# EAGLE design TPDH-Walrus_HardMount (EAGLE 9.4.2)
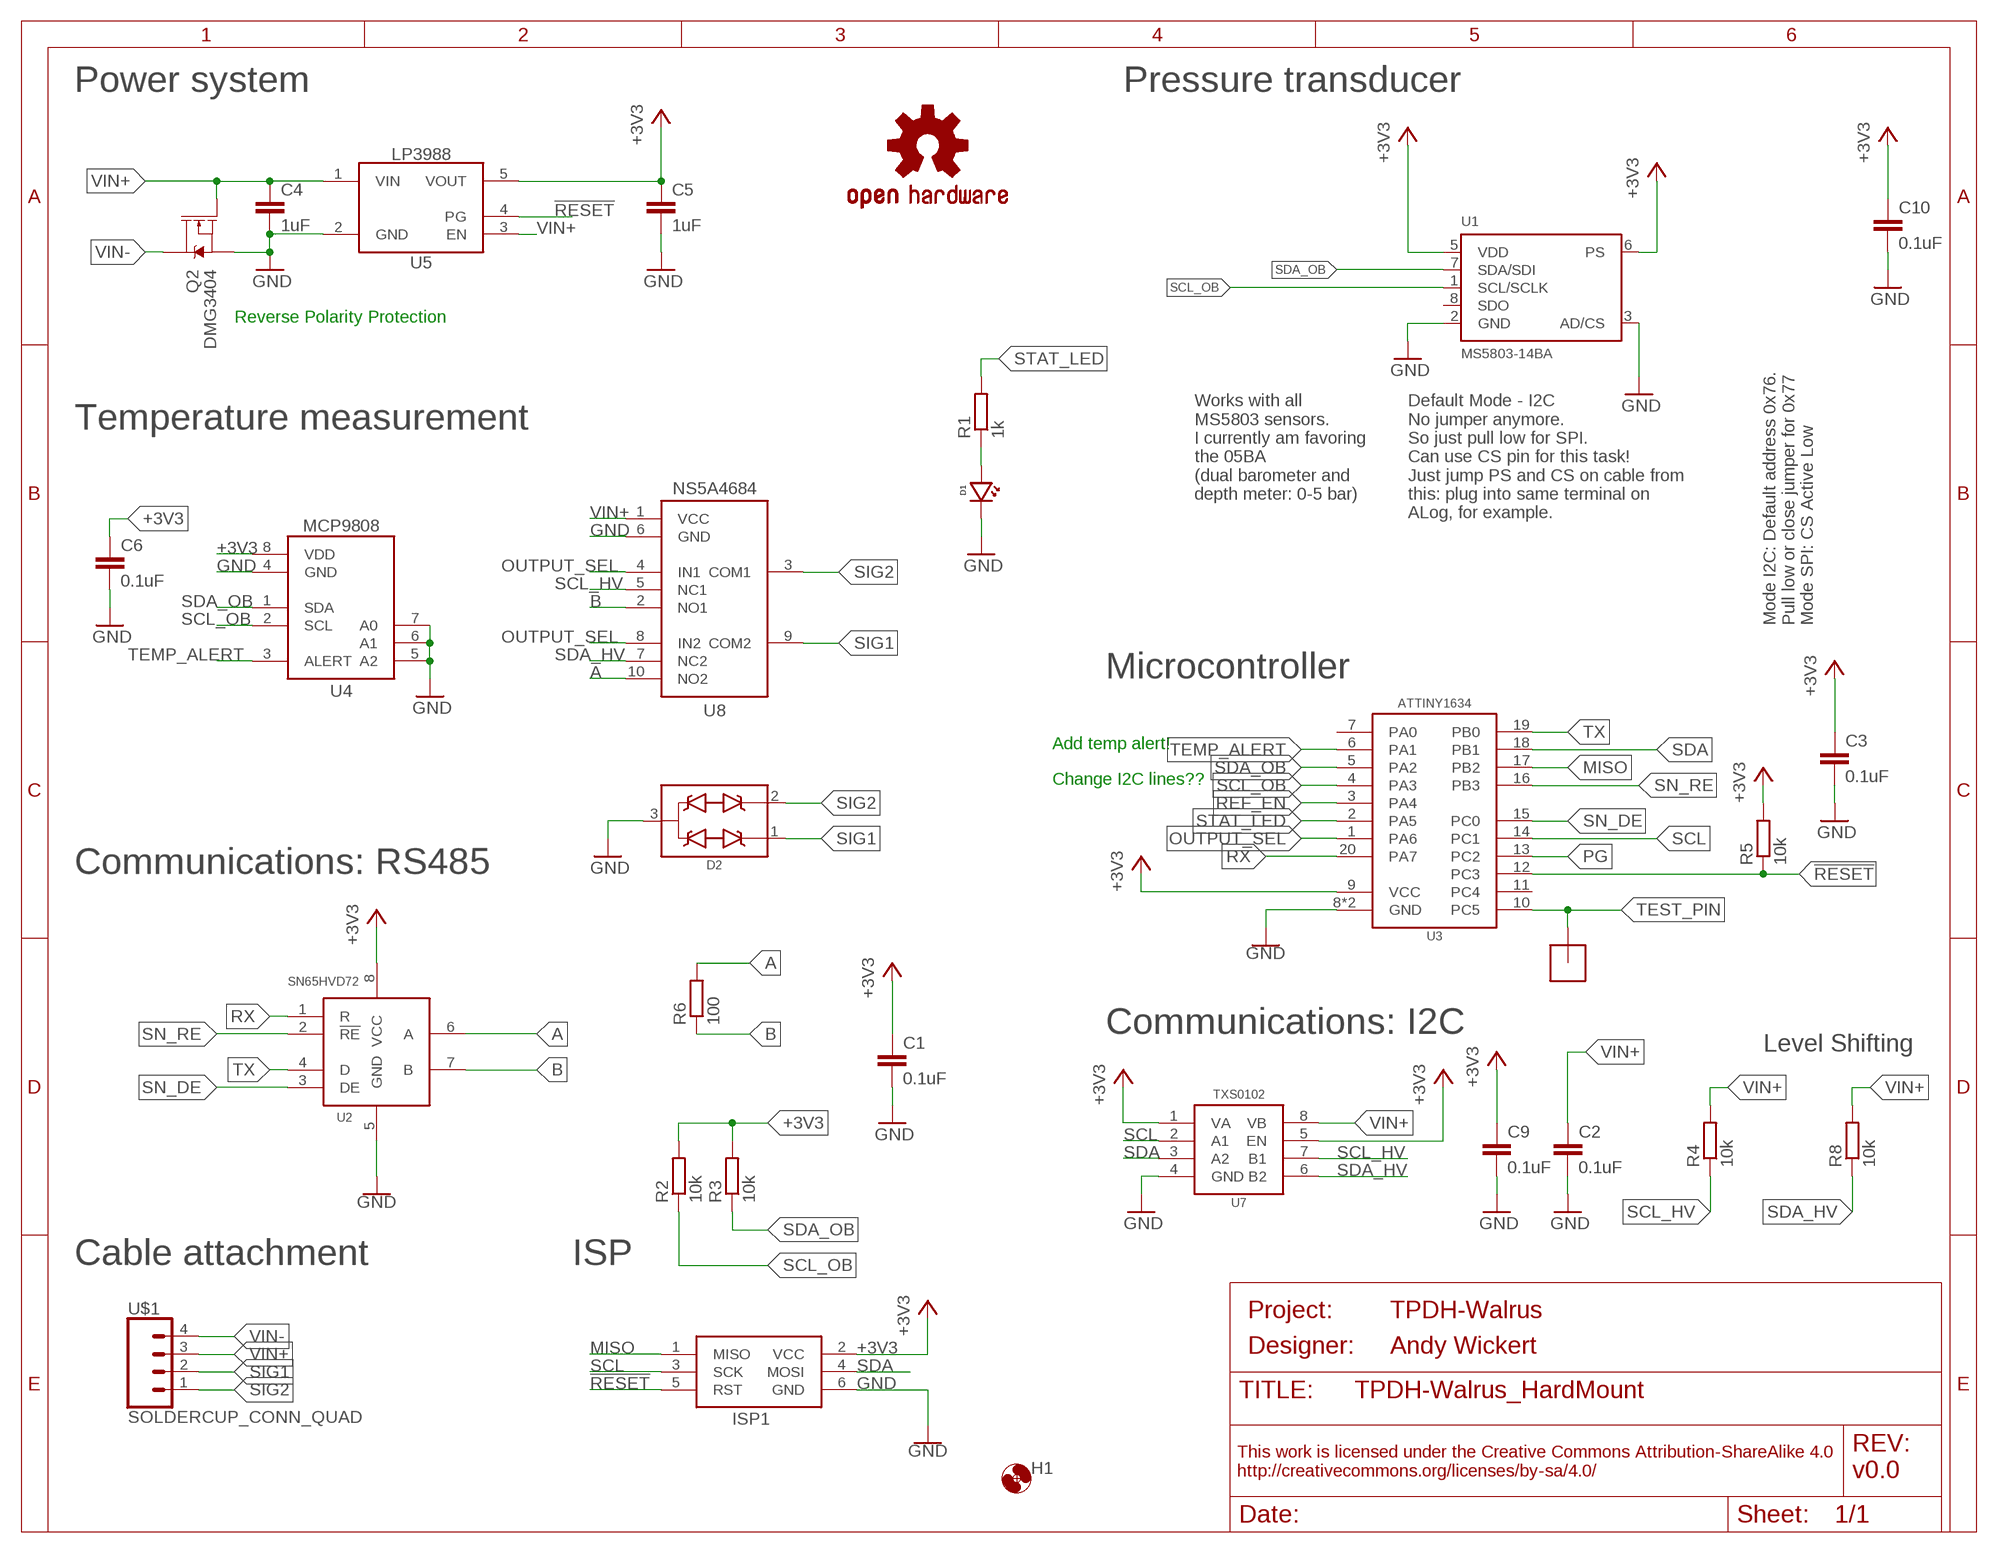
[diagram p0: schematic, sheet 1]
FRAME1 (FRAME_A_L): DESIGNER: Andy Wickert; PROJECT: TPDH-Walrus; REV: v0.0

## Parts
C1  0.1uF  C-EU0.1UFC0402  [C0402]
C2  0.1uF  C-EU0.1UFC0402  [C0402]
C3  0.1uF  C-EU0.1UFC0402  [C0402]
C4  1uF  C-EU1UFC0603  [C0603]
C5  1uF  C-EU1UFC0603  [C0603]
C6  0.1uF  C-EU0.1UFC0402  [C0402]
C9  0.1uF  C-EU0.1UFC0402  [C0402]
C10  0.1uF  C-EU0.1UFC0402  [C0402]
D1  LEDBLUE0603  [LED_0603]
D2  TVSSM712  [SOT23-3]
H1  MOUNTING_HOLE2_NP  [2_56]
ISP1  AVRISP-6  [AVRISP]
LOGO1  OSHW-LOGOM  [OSHW-LOGO-M]
Q2  DMG3404  MOSFET-NCH-DMG3404L  [SOT23-3]
R1  1k  R-EU_1KR0603  [R0603]
R2  10k  R-EU_10KR0402  [R0402]
R3  10k  R-EU_10KR0402  [R0402]
R4  10k  R-EU_10KR0402  [R0402]
R5  10k  R-EU_10KR0402  [R0402]
R6  100  R-EU_100R0402  [R0402]
R8  10k  R-EU_10KR0402  [R0402]
U1  MS5803-14BA  [MS5803]
U2  SN65HVD72DSOIC  [SO08]
U3  ATTINY1634QFN  [QFN20]
U4  MCP9808MSOP  [MSOP_8]
U5  LP39883.3VDBV  [DBV0005A]
U7  TXS0102DQM  [DQM_R-PX2SON-N8]
U8  NS5A4684S  [WQFN10]
U$1  SOLDERCUP_CONN_QUAD  [SOLDERCUP_CONN_QUAD]
U$12  POGO_PAD  [POGO_PAD]

## Nets
!RESET: ISP1.5(RST) R5.1 U3.12(PC3) U5.4(PG)
+3V3: C1.1 C3.1 C5.1 C6.1 C9.1 C10.1 ISP1.2(VCC) R2.2 R3.2 R5.2 U1.5(VDD) U1.6(PS) U2.8(VCC) U3.9(VCC) U4.8(VDD) U5.5(VOUT) U7.1(VA) U7.5(EN)
A: R6.2 U2.6(A) U8.10(NO2)
B: R6.1 U2.7(B) U8.2(NO1)
GND: C1.2 C2.2 C3.2 C4.2 C5.2 C6.2 C9.2 C10.2 D1.CATHODE D2.3(COM) ISP1.6(GND) Q2.2(S) U1.2(GND) U1.3(AD/CS) U2.5(GND) U3.8(GND) U3.EP(GND) U4.4(GND) U4.5(A2) U4.6(A1) U4.7(A0) U5.2(GND) U7.4(GND) U8.6(GND)
MISO: ISP1.1(MISO) U3.17(PB2)
N$2: D1.ANODE R1.1
OUTPUT_SEL: U3.1(PA6) U8.4(IN1) U8.8(IN2)
PG: U3.13(PC2)
REF_EN: U3.3(PA4)
RX: U2.1(R) U3.20(PA7)
SCL: ISP1.3(SCK) U3.14(PC1) U7.2(A1)
SCL_HV: R4.1 U7.7(B1) U8.5(NC1)
SCL_OB: R2.1 U1.1(SCL/SCLK) U3.4(PA3) U4.2(SCL)
SDA: ISP1.4(MOSI) U3.18(PB1) U7.3(A2)
SDA_HV: R8.1 U7.6(B2) U8.7(NC2)
SDA_OB: R3.1 U1.7(SDA/SDI) U3.5(PA2) U4.1(SDA)
SIG1: D2.1(D1) U8.9(COM2) U$1.2
SIG2: D2.2(D2) U8.3(COM1) U$1.1
SN_DE: U2.3(DE) U3.15(PC0)
SN_RE: U2.2(!RE) U3.16(PB3)
STAT_LED: R1.2 U3.2(PA5)
TEMP_ALERT: U3.6(PA1) U4.3(ALERT)
TEST_PIN: U3.10(PC5) U$12.P$1
TX: U2.4(D) U3.19(PB0)
VIN+: C2.1 C4.1 Q2.1(G) R4.2 R8.2 U5.1(VIN) U5.3(EN) U7.8(VB) U8.1(VCC) U$1.3
VIN-: Q2.3(D) U$1.4
Unconnected: U1.8(SDO) U3.7(PA0) U3.11(PC4)

## Notes on the sheet
- Power system | Pressure transducer
- Reverse Polarity Protection
- Works with all
  MS5803 sensors.
  I currently am favoring
  the 05BA
  (dual barometer and
  depth meter: 0-5 bar)
- Default Mode - I2C
  No jumper anymore.
  So just pull low for SPI.
  Can use CS pin for this task!
  Just jump PS and CS on cable from
  this: plug into same terminal on
  ALog, for example.
- Temperature measurement
- Mode I2C: Default address 0x76.
  Pull low or close jumper for 0x77
  Mode SPI: CS Active Low
- Microcontroller
- Add temp alert!
- Change I2C lines??
- Communications: RS485
- Communications: I2C
- Level Shifting
- Cable attachment | ISP

## Library data of the parts
C1-C3 C6 C9 C10 = bschulz_passives:C-EU: CAPACITOR, European symbol; DIGIKEY: 490-4759-1-ND; MF: Murata; MPN: GCM155R71C104KA55D
C4 C5 = bschulz:C-EU: CAPACITOR, European symbol; DIGIKEY: 1276-6524-1-ND; MF: Samsung; MPN: 1276-6524-1-ND
D1 = bschulz:LED: Genaric LED; DIGIKEY: 732-4966-1-ND; MF: Wurth; MPN: 150060BS75000
D2 = bschulz:TVS: Generic dual channel TVS diode; DIGIKEY: CDSOT23-SM712CT-ND; MF: Bourns; MPN: CDSOT23-SM712
H1 = bschulz:MOUNTING_HOLE: Genaric Mechanical Mounting Hole Hole diameter based on max body diameter + 15% Keepout ring is for diameter of socket cap screw (minimum required clearance) TPlace ring is for diameter of pan head screw (recomended clearance) Specifications: Socket Cap <http://fastener-express.com/fastener-technical/SocketscapSS-Alloy.pdf> Button Head Socket Cap <http://fastener-express.com/fastener-technical/Button-Socket-alloy.pdf> Pan Head <http://fastener-express.com/fastener-technical/pan-machine-Screws.pdf>
ISP1 = bschulz:AVRISP: AVR ISP HEADER Standard 6 pin header for AVR programming
LOGO1 = SparkFun-Aesthetics:OSHW-LOGO: Open-Source Hardware (OSHW) Logo This logo indicates the piece of hardware it is found on incorporates a OSHW license and/or adheres to the definition of open source hardware found here: http://freedomdefined.org/OSHW
Q2 = bschulz:MOSFET-NCH: N-channel MOSFETs Voltage controlled devices that allow control of high current outputs. SparkFun Products: SparkFun OpenScale <https://www.sparkfun.com/products/13261> SparkFun Digital Sandbox <https://www.sparkfun.com/products/12651> SparkFun Monster Moto Shield <https://www.sparkfun.com/products/10182> SparkFun MOSFET Power Controller <https://www.sparkfun.com/products/11214>; DIGIKEY: DMG3404L-7DICT-ND; MF: Diodes Incorporated; MPN: DMG3404L-7
R1 = bschulz_passives:R-EU_: RESISTOR, European symbol Digikey Parts: Yageo, 0402 <https://www.digikey.com/products/en/resistors/chip-resistor-surface-mount/52?k=&pkeyword=&sf=0&FV=ffec1104%2Cfffc000d%2C1c0002%2C440067%2C1f140000%2Cffe00034%2C400004&quantity=&ColumnSort=0&page=1&stock=1&pageSize=25> Yageo, 0603 <https://www.digikey.com/products/en/resistors/chip-resistor-surface-mount/52?k=&pkeyword=&s=4356&s=47360&sf=0&FV=fffc000d%2C1c0002%2C142c040c%2C1f140000%2Cffe00034&quantity=10&ColumnSort=1000011&page=1&stock=1&pageSize=25> Panasonic, 0603 <https://www.digikey.com/products/en/resistors/chip-resistor-surface-mount/52?k=&pkeyword=&pv252=68&sf=0&FV=ffec373d%2C1c0002%2C142c040c%2C1f140000%2Cffe00034%2C80002%2Cc0001&quantity=&ColumnSort=0&page=1&stock=1&pageSize=25> Panasonic, precision, 0603 <https://www.digikey.com/products/en/resistors/chip-resistor-surface-mount/52?FV=ffec4907%2Cfffc000a%2Cc0172%2C142c040c%2C1f140000%2Cffe00034%2C1c0002&quantity=100&ColumnSort=2085&page=1&stock=1&pageSize=25> Panasonic, 0805 <https://www.digikey.com/products/en/resistors/chip-resistor-surface-mount/52?k=&pkeyword=&pv3=1&sf=0&FV=ffec373d%2C1c0002%2C1f140000%2Cffe00034%2C142c040d&quantity=&ColumnSort=0&page=1&stock=1&pageSize=25> Rohm, current sense <https://www.digikey.com/products/en/resistors/chip-resistor-surface-mount/52?k=&pkeyword=&pv3=1&sf=0&FV=ffecb688%2C1f140000%2Cffe00034%2C1c0002&quantity=&ColumnSort=0&page=1&stock=1&pageSize=25> Vishay, pulse proof automotive <https://www.digikey.com/products/en/resistors/chip-resistor-surface-mount/52?k=&pkeyword=&pv7=2&sf=0&FV=ffec5d6b%2Cffe00034%2C1f140000&quantity=&ColumnSort=0&page=1&stock=1&pageSize=25>; DIGIKEY: 311-1KLDCT-ND; MF: Yageo; MPN: AC0603FR-071KL; VALUE_PART: 1k
R2-R5 R8 = bschulz_passives:R-EU_: RESISTOR, European symbol Digikey Parts: Yageo, 0402 <https://www.digikey.com/products/en/resistors/chip-resistor-surface-mount/52?k=&pkeyword=&sf=0&FV=ffec1104%2Cfffc000d%2C1c0002%2C440067%2C1f140000%2Cffe00034%2C400004&quantity=&ColumnSort=0&page=1&stock=1&pageSize=25> Yageo, 0603 <https://www.digikey.com/products/en/resistors/chip-resistor-surface-mount/52?k=&pkeyword=&s=4356&s=47360&sf=0&FV=fffc000d%2C1c0002%2C142c040c%2C1f140000%2Cffe00034&quantity=10&ColumnSort=1000011&page=1&stock=1&pageSize=25> Panasonic, 0603 <https://www.digikey.com/products/en/resistors/chip-resistor-surface-mount/52?k=&pkeyword=&pv252=68&sf=0&FV=ffec373d%2C1c0002%2C142c040c%2C1f140000%2Cffe00034%2C80002%2Cc0001&quantity=&ColumnSort=0&page=1&stock=1&pageSize=25> Panasonic, precision, 0603 <https://www.digikey.com/products/en/resistors/chip-resistor-surface-mount/52?FV=ffec4907%2Cfffc000a%2Cc0172%2C142c040c%2C1f140000%2Cffe00034%2C1c0002&quantity=100&ColumnSort=2085&page=1&stock=1&pageSize=25> Panasonic, 0805 <https://www.digikey.com/products/en/resistors/chip-resistor-surface-mount/52?k=&pkeyword=&pv3=1&sf=0&FV=ffec373d%2C1c0002%2C1f140000%2Cffe00034%2C142c040d&quantity=&ColumnSort=0&page=1&stock=1&pageSize=25> Rohm, current sense <https://www.digikey.com/products/en/resistors/chip-resistor-surface-mount/52?k=&pkeyword=&pv3=1&sf=0&FV=ffecb688%2C1f140000%2Cffe00034%2C1c0002&quantity=&ColumnSort=0&page=1&stock=1&pageSize=25> Vishay, pulse proof automotive <https://www.digikey.com/products/en/resistors/chip-resistor-surface-mount/52?k=&pkeyword=&pv7=2&sf=0&FV=ffec5d6b%2Cffe00034%2C1f140000&quantity=&ColumnSort=0&page=1&stock=1&pageSize=25>; DIGIKEY: 311-10.0KHRCT-ND; MF: Yageo; MPN: RC0603FR-0710KL; VALUE_PART: 10k
R6 = bschulz_passives:R-EU_: RESISTOR, European symbol Digikey Parts: Yageo, 0402 <https://www.digikey.com/products/en/resistors/chip-resistor-surface-mount/52?k=&pkeyword=&sf=0&FV=ffec1104%2Cfffc000d%2C1c0002%2C440067%2C1f140000%2Cffe00034%2C400004&quantity=&ColumnSort=0&page=1&stock=1&pageSize=25> Yageo, 0603 <https://www.digikey.com/products/en/resistors/chip-resistor-surface-mount/52?k=&pkeyword=&s=4356&s=47360&sf=0&FV=fffc000d%2C1c0002%2C142c040c%2C1f140000%2Cffe00034&quantity=10&ColumnSort=1000011&page=1&stock=1&pageSize=25> Panasonic, 0603 <https://www.digikey.com/products/en/resistors/chip-resistor-surface-mount/52?k=&pkeyword=&pv252=68&sf=0&FV=ffec373d%2C1c0002%2C142c040c%2C1f140000%2Cffe00034%2C80002%2Cc0001&quantity=&ColumnSort=0&page=1&stock=1&pageSize=25> Panasonic, precision, 0603 <https://www.digikey.com/products/en/resistors/chip-resistor-surface-mount/52?FV=ffec4907%2Cfffc000a%2Cc0172%2C142c040c%2C1f140000%2Cffe00034%2C1c0002&quantity=100&ColumnSort=2085&page=1&stock=1&pageSize=25> Panasonic, 0805 <https://www.digikey.com/products/en/resistors/chip-resistor-surface-mount/52?k=&pkeyword=&pv3=1&sf=0&FV=ffec373d%2C1c0002%2C1f140000%2Cffe00034%2C142c040d&quantity=&ColumnSort=0&page=1&stock=1&pageSize=25> Rohm, current sense <https://www.digikey.com/products/en/resistors/chip-resistor-surface-mount/52?k=&pkeyword=&pv3=1&sf=0&FV=ffecb688%2C1f140000%2Cffe00034%2C1c0002&quantity=&ColumnSort=0&page=1&stock=1&pageSize=25> Vishay, pulse proof automotive <https://www.digikey.com/products/en/resistors/chip-resistor-surface-mount/52?k=&pkeyword=&pv7=2&sf=0&FV=ffec5d6b%2Cffe00034%2C1f140000&quantity=&ColumnSort=0&page=1&stock=1&pageSize=25>; DIGIKEY: 311-100LRCT-ND; MF: Yageo; MPN: RC0402FR-07100RL; VALUE_PART: 100
U1 = MS5803:MS5803-14BA; DIGIKEY: 223-1625-5-ND; MF: TE; MPN: MS580305BA01-00; PROD_ID: IC-12111
U2 = bschulz:SN65HVD72: SN65HVD72 - Half Duplex RS-485 Tranciver, with output enable Characteristics: VCC: 3~3.6V Operating Temperature: -40°C to 125°C Digikey: 296-39179-1-ND (D) <https://www.digikey.com/product-detail/en/texas-instruments/SN65HVD72DR/296-39179-1-ND/5143186>; DIGIKEY: 296-39179-1-ND; DISP: SN65HVD72; MF: TI; MPN: SN65HVD72DR
U3 = bschulz:ATTINY1634: ATtiny1634 8 bit AVR Microcontroller Features: Vcc: 1.8 ~ 5.5V Clock: Up to 16MHz, Internal 8MHz FRC, 32kHz RC Flash Memory: 16K SRAM: 1K EEPROM: 256B ADC: 10b, 12 port USART: Yes, x2 SPI: Yes I2C: Yes, slave only Notes: 2 analog comp. Digikey: ATTINY1634R-MURCT-ND (QFN) <https://www.digikey.com/product-detail/en/microchip-technology/ATTINY1634R-MUR/ATTINY1634R-MURCT-ND/3440781> ATTINY1634R-SU-ND (SOIC) <https://www.digikey.com/product-detail/en/ATTINY1634R-SU/ATTINY1634R-SU-ND/3128699/?itemSeq=272981030>; DIGIKEY: ATTINY1634-MURCT-ND; MF: Atmel; MPN: ATTINY1634-MUR
U4 = bschulz:MCP9808: MCP9808 - Digital Temperature Sensor Characteristics: VCC: 2.7~5.5V Operating Temperature: -40°C to 125°C Accuracy: ±0.25°C (-40 to +125°C) IQ: 200μA (0.1μA Shutdown) Resolution: 0.0625°C Digikey: MCP9808T-E/MSCT-ND (MSOP) <https://www.digikey.com/product-detail/en/microchip-technology/MCP9808T-E-MS/MCP9808T-E-MSCT-ND/5169548> MCP9808T-E/MCCT-ND (DFN) <https://www.digikey.com/product-detail/en/microchip-technology/MCP9808T-E-MC/MCP9808T-E-MCCT-ND/2802117>; DIGIKEY: MCP9808T-E/MSCT-ND; MF: Microchip; MPN: MCP9808T-E/MS
U5 = bschulz:LP3988: TPS7A05* - Ultra Low Power Ultra Low Dropout Linear Regulator with Power Good Characteristics: Vin: 2.5V ~ 6V Vout: 1.8, 2.5, 2.85, 3.3V fixed IQ: 85μA typ, 200μA max Voltage Accuracy: 2% typ, 3.5% max Output Current: 150 mA Operating Temperature: -40°C to 125°C Digikey: LP3988IMF-3.3/NOPBCT-ND (3.3V Fixed) <https://www.digikey.com/products/en/integrated-circuits-ics/pmic-voltage-regulators-linear/699?k=LP3988&k=&pkeyword=LP3988&sv=0&pv1779=50&sf=0&FV=1c0002%2Cffe002bb%2C1f140000&quantity=&ColumnSort=0&page=1&pageSize=25>; DIGIKEY: LP3988IMF-3.3/NOPBCT-ND; MF: TI; MPN: LP3988IMF-3.3/NOPB
U7 = bschulz:TXS0102: TXS0102 - 2 Channel Bidirectional Voltage Level Translator Characteristics: Vcc: 1.65 ~ 3.6V (Port A), 2.3 ~ 5.5V (Port B) IQ: 14.4μA Output Current: 50mA Output Type: Open Drain/Push-Pull Operating Temperature: -40°C to 85°C Digikey: 296-28368-1-ND (DQE) <https://www.digikey.com/product-detail/en/texas-instruments/TXS0102DQER/296-28368-1-ND/2625893> 296-28435-1-ND (DQM) <https://www.digikey.com/product-detail/en/texas-instruments/TXS0102DQMR/296-28435-1-ND/2638910> 296-21931-1-ND (DCU) <https://www.digikey.com/product-detail/en/texas-instruments/TXS0102DCUR/296-21931-1-ND/1629284>; DIGIKEY: 296-28435-1-ND; MF: TI; MPN: TXS0102DQMR
U8 = bschulz:NS5A4684S: NS5A4684S - Dual Analog Multiplexer (1:2) Characteristics: VCC: 1.65~5.5V Operating Temperature: -40°C to 85°C Digikey: NS5A4684SMNTAGOSCT-ND (10-WFQFN) <https://www.digikey.com/product-detail/en/on-semiconductor/NS5A4684SMNTAG/NS5A4684SMNTAGOSCT-ND/9087458>; DIGIKEY: NS5A4684SMNTAGOSCT-ND; DISP: NS5A4684; MF: ON Semiconductor; MPN: NS5A4684SMNTAG
U$1 = bschulz:SOLDERCUP_CONN_QUAD
U$12 = bschulz:POGO_PAD: POGO Pad SMD pad for interfacing with POGO Pins

## Board
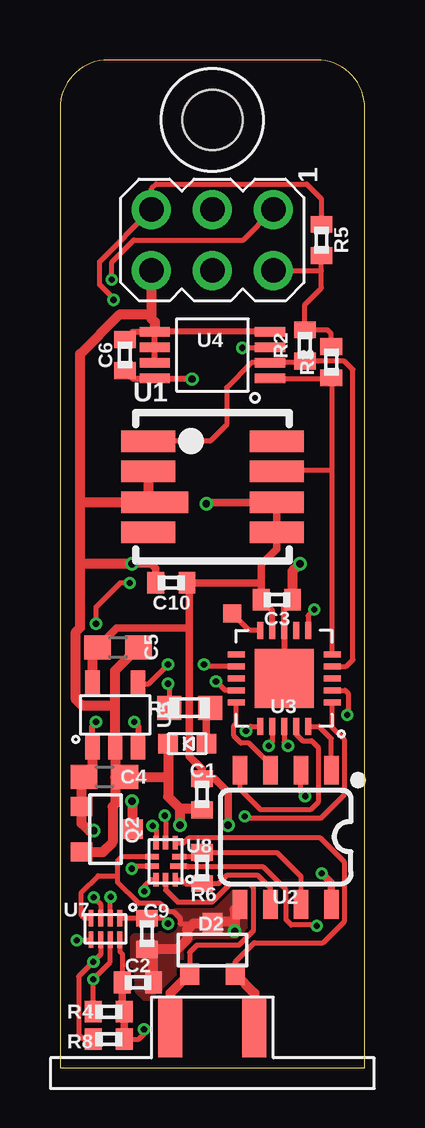
[diagram p1: board, top side]
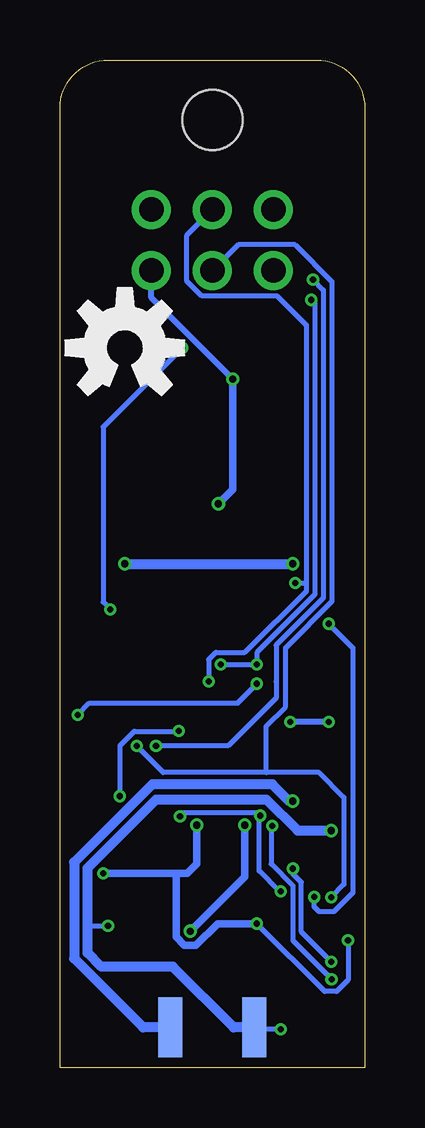
[diagram p2: board, bottom side, seen from below]

Size 12.7 x 42 mm. Coordinates in mm from the lower left corner, seen from the top.
Outline: 12.7,0 12.7,40 arc90 10.7,42 2,42 arc90 0,40 0,0 12.7,0
Copper layers (1*16): Top 0.035559375mm / dielectric 1.6mm / Bottom 0.035559375mm
Design rules "oshpark-2layer": minimum track width 6mil, minimum drill 10mil, track to track 6mil, track to pad 6mil, pad to pad 6mil, via to via 6mil, smd to smd 6mil, copper to edge 15mil, drill to drill 6mil, minimum pad ring 5mil, minimum via ring 5mil, stop-mask expansion 2.5mil, vias tented up to drill 0mil, thermal gap 10mil

### Footprints (pad centres in the part's own frame; a part is rotated, then mirrored left to right if it is on the bottom)
C0402 = smd 0.7 x 0.9: 1 -0.65,0; 2 0.65,0
C0603 = smd 1.1 x 1: 1 -0.85,0; 2 0.85,0
LED_0603 = smd 0.8 x 0.8: ANODE 0.8,0; CATHODE -0.8,0
SOT23-3 = smd 0.8 x 0.9: 1 -0.95,-1; 2 0.95,-1; 3 0,1.1
2_56 = hole 2.5: 0,0
AVRISP = drill 1.02 pad 1.626: 1 -1.27,2.54; 2 1.27,2.54; 3 -1.27,0; 4 1.27,0; 5 -1.27,-2.54; 6 1.27,-2.54
R0603 = smd 1 x 1: 1 -0.85,0; 2 0.85,0
R0402 = smd 0.7 x 0.9: 1 -0.65,0; 2 0.65,0
MS5803 = smd 2.25 x 0.9: 1 -2.675,1.9; 2 -2.675,0.65; 4 -2.675,-1.9; 5 2.675,-1.9; 6 2.675,-0.65; 7 2.675,0.65; 8 2.675,1.9 | smd 2.8 x 0.9: 3 -2.4,-0.65
SO08 = smd 0.6 x 1.2: 1 -1.905,-2.8; 2 -0.635,-2.8; 3 0.635,-2.8; 4 1.905,-2.8; 5 1.905,2.8; 6 0.635,2.8; 7 -0.635,2.8; 8 -1.905,2.8
QFN20 = smd 0.7 x 0.25: 1 -2.032,0.968; 2 -2.032,0.468; 3 -2.032,-0.032; 4 -2.032,-0.532; 5 -2.032,-1.032; 11 1.968,-1.032; 12 1.968,-0.532; 13 1.968,-0.032; 14 1.968,0.468; 15 1.968,0.968 | smd 0.25 x 0.7: 6 -1.032,-2.032; 7 -0.532,-2.032; 8 -0.032,-2.032; 9 0.468,-2.032; 10 0.968,-2.032; 16 0.968,1.968; 17 0.468,1.968; 18 -0.032,1.968; 19 -0.532,1.968; 20 -1.032,1.968 | smd 2.45 x 2.45: EP -0.032,-0.032
MSOP_8 = smd 1.26 x 0.4: 1 -2.4,0.975; 2 -2.4,0.325; 3 -2.4,-0.325; 4 -2.4,-0.975; 5 2.4,-0.975; 6 2.4,-0.325; 7 2.4,0.325; 8 2.4,0.975
DBV0005A = smd 1.1 x 0.6: 1 -1.3,0.95; 2 -1.3,0; 3 -1.3,-0.95; 4 1.3,-0.95; 5 1.3,0.95
DQM_R-PX2SON-N8 = smd 0.2 x 0.7: 1 -0.6,-0.45; 2 -0.2,-0.45; 3 0.2,-0.45; 4 0.6,-0.45; 5 0.6,0.45; 6 0.2,0.45; 7 -0.2,0.45; 8 -0.6,0.45
WQFN10 = smd 0.663 x 0.225: 1 -0.518,0.2 | smd 0.563 x 0.225: 2 -0.569,-0.2; 6 0.569,-0.2; 7 0.569,0.2 | smd 0.225 x 0.563: 3 -0.4,-0.768; 4 0,-0.768; 5 0.4,-0.768; 8 0.4,0.768; 9 0,0.768; 10 -0.4,0.768
SOLDERCUP_CONN_QUAD = smd 1 x 2.5: 1 1.75,1.27; 2 -1.75,1.27 | smd 1 x 2.5 bottom: 3 -1.75,1.27; 4 1.75,1.27
POGO_PAD = smd 0.75 x 0.75: P$1 0,0

### Placement (x,y rotation side)
C1  5.92,11.39 270 top
C2  3.24,3.55 0 top
C3  9.04,19.5 0 top
C4  1.85,12.12 0 top
C5  2.42,17.51 0 top
C6  2.7,29.7 90 top
C9  3.62,5.58 270 top
C10  4.64,20.2 180 top
D1  5.3,13.5 0 top
D2  6.35,4.9 0 top
H1  6.35,39.5 0 top
ISP1  6.35,34.49 270 top
LOGO1  10,30 0 bottom
Q2  1.9,9.94 270 top
R1  5.4,15 180 top
R2  10.2,30.1 90 top
R3  11.3,29.4 90 top
R4  2.03,2.33 0 top
R5  10.89,34.49 270 top
R6  5.92,8.31 270 top
R8  2.03,1.18 0 top
U1  6.35,24.21 0 top
U2  9.4,9.6 180 top
U3  9.31,16.19 180 top
U4  6.35,29.7 180 top
U5  2.3,14.7 90 top
U7  1.89,5.78 180 top
U8  4.4,8.6 180 top
U$1  6.35,0.4 0 top
U$12  7.18,18.93 0 top

### Tracks (layer width: path | path; a pad name or v marks a point on that pad's centre or on a via)
!RESET  (via drill 0.25)
  Top 0.2: v4.5,16.8 3.7,16 U5.4 | U3.12 6.08,16.72 v6,16.8 | v2.23,32 2.23,32.05 1.65,32.63 1.65,33.6 ISP1.5 3.81,36.63 4.01,36.83 10.28,36.83 10.89,36.21 R5.1
  Bottom 0.2: v2.23,32 2.08,31.85 2.08,19.73 4.1,17.7 4.5,17.3 v4.5,16.8 v6,16.8
+3V3  (via drill 0.25, 0.3)
  Top 0.2: 11.3,6.6 U2.8 | U7.1 C9.1 4.27,6.23 v4.5,6 | U7.5 1.26,5.3 v0.7,5.3 | 10.89,33.2 10.89,32.49 10.2,31.8 R2.2 11.15,30.75 11.3,30.6 R3.2 | 10.89,33.2 R5.2 | ISP1.2 10.87,33.22 10.89,33.2
  Top 0.254: C6.1 3.02,28.73 U4.8 5.47,28.73 v5.5,28.7 | U3.9 8.84,19.05 C3.1
  Top 0.305: v10.9,8.1 11.3,7.7 11.3,6.6 | C3.1 8.39,20.3 | 8.39,20.3 8.39,20.97 9.03,21.61 U1.5 U1.6 6.16,23.56 v6.1,23.5 | 8.39,20.3 8.29,20.2 C10.1 5.39,20.1 5.39,18.3 | C5.1 2.37,18.32 5.38,18.32 5.39,18.3 | v7,10.1 7,11.46 6.42,12.04 C1.1 5.92,12.44 5.39,12.97 5.39,18.3
  Top 0.406: C5.1 1.35,17.3 U5.5
  Bottom 0.2: v0.7,5.3 0.7,3.65 1.18,3.17 1.68,3.17 v4.5,6
  Bottom 0.254: v5.5,28.7 8.89,32.09 ISP1.2
  Bottom 0.305: v10.9,8.1 7.9,8.1 | v5.5,28.7 5.5,24.1 v6.1,23.5 | 7.9,8.1 7.86,8.06 7.86,5.44 7.52,5.1 7.03,5.1 6.13,6 v4.5,6 | v7,10.1 7,8.5 7.4,8.1 7.9,8.1
A
  Top 0.2: U8.10 5.05,7.83 5.22,7.66 R6.2 6.6,7.66 6.94,8.01 8.25,8.01 8.77,7.49 U2.6
B
  Top 0.2: U8.2 5.75,8.8 R6.1 9.04,8.96 10.04,7.96 U2.7
GND  (via drill 0.3)
  Top 0.2: U7.4 0.99,6.23 0.89,6.33 0.89,7.31 1.58,8 2.39,8 | U8.6 2.6,8.8 2.39,8.59 2.39,8 | 6,6 5.01,6 5.01,6.01 5.01,6.21 4.71,6.51 4.51,6.51 4.18,6.83 3.28,6.83 2.39,7.72 2.39,8
  Top 0.254: C6.2 3.02,30.68 U4.5 | U4.7 U4.6 U4.5 | U4.4 U4.5 | C3.2 9.34,19.16 U3.8 U3.EP
  Top 0.305: C1.2 5.84,10.74 | v3,21 3.79,21 3.99,20.8 C10.2
  Top 0.406: C3.2 9.69,20.69 v10,21 | 0.84,21 0.84,23.6 | 0.84,23.6 0.84,29.75 2.49,31.4 3.81,31.4 | v3,21 0.84,21 | U1.2 3.67,23.83 U1.3 0.88,23.56 0.84,23.6 | 3.89,4.93 4.89,4.93 5.3,5.34 5.3,5.74 5.56,6 6,6 D2.3 6.45,6.1 7.28,6.1 | 3.89,4.93 C9.2 | C2.2 3.89,4.93 | ISP1.6 3.81,31.4 | 3.81,31.4 3.81,31.21 3.95,31.07 U4.5 | U2.5 7.28,6.58 7.28,6.1 | 7.28,6.1 v7.28,5.68 | Q2.2 1.78,8.98 2.19,9.39 2.19,10.88 2.3,10.99 2.3,12.1 | 2.7,12.1 C4.2 | 0.84,21 0.84,18.34 0.66,18.16 0.66,15.34 0.9,15.09 2.29,15.09 2.3,15.1 | C5.2 2.3,16.55 2.3,15.1 | 2.3,15.1 U5.2 2.3,12.1 | v5,10.1 5,10.78 | D1.CATHODE 4.5,12.1 | 4.5,12.1 4.5,11.28 5,10.78 | 4.5,12.1 4.48,12.12 C4.2 | C1.2 5.88,10.78 5,10.78 | C4.2 2.32,12.12 2.3,12.1
  Bottom 0.305: v7.28,5.68 5,7.96 v5,10.1
  Bottom 0.406: v10,21 v3,21
  pour Top (no thermals): 6.4,6.9 5.2,6.9 4.2,5.9 4.2,5.6 4.1,5.5 3.1,5.5 3,5.4 3,4.2 3.2,4 3.2,3.2 3.5,2.9 8.8,2.9 9,3.1 9,6.9 8.3,7.6 7.1,7.6
MISO  (via drill 0.25)
  Top 0.2: U3.17 8.84,13.55 v8.7,13.41 | v2.16,32.84 2.16,33.58 3.08,34.5 7.63,34.5 ISP1.1
  Bottom 0.2: v8.7,13.41 5.69,13.41 3.7,15.4 3.7,16.08 3.69,16.08 3.69,17.61 1.72,19.58 1.72,32.41 v2.16,32.84
N$2
  Top 0.305: R1.1 6.1,14.85 D1.ANODE
OUTPUT_SEL  (via drill 0.25)
  Top 0.2: U8.8 3.8,7.83 3.51,7.54 v3.51,7.34 | U8.4 4.41,10.45 v4.36,10.5 | U3.1 11.34,14.16 11.86,13.65 11.86,11.39 10.86,10.39 7.77,10.39 v7.7,10.47
  Bottom 0.2: v7.7,10.47 7.7,10.63 4.48,10.63 v4.36,10.51 v4.36,10.5 4.41,10.45 4.41,8.19 3.56,7.34 v3.51,7.34
PG
  Top 0.2: 7.33,16.21 U3.13
RX
  Top 0.2: U2.1 11.3,13.7 10.79,14.22 U3.20
SCL  (via drill 0.25)
  Top 0.2: U3.14 6.88,15.72 v6.5,16.1 | v2.9,20.2 2.5,20.2 1.5,19.2 v1.5,18.5 | U7.2 2.09,7.09 v2.11,7.11
  Bottom 0.2: ISP1.3 7.42,34.7 7.42,32.78 6.79,32.16 3.66,32.16 2.43,30.93 2.43,20.2 | 2.43,20.2 2.43,19.87 4.99,17.31 6.21,17.31 6.51,17.01 v6.51,16.11 v6.5,16.1 | v1.5,18.5 0.49,17.49 0.49,7.29 1.28,6.5 1.9,6.5 2.11,6.71 v2.11,7.11 | v2.9,20.2 2.43,20.2
SCL_HV  (via drill 0.25)
  Top 0.2: R4.1 v1.38,3.68 | U7.7 2.09,4.39 v1.38,3.68 | v1.38,3.68 v1.39,3.68 | v3.86,10.07 4,9.93 U8.5
  Bottom 0.2: v1.39,3.68 3,5.3 3,7.58 3.9,8.48 3.9,10.03 v3.86,10.07
SCL_OB
  Top 0.2: U3.4 11.92,16.72 12.2,17 12.2,29.1 11.85,29.45 10.74,29.45 R2.1 10.13,29.38 8.9,29.38 | 8.93,29.4 U4.2 8.9,29.38 | 8.9,29.38 8.7,29.38 7.98,29.38 6.95,28.35 6.95,26.8 6.26,26.11 U1.1
SDA  (via drill 0.25)
  Top 0.2: v1.4,7.1 1.69,6.81 U7.3 | U3.18 9.34,13.56 v9.5,13.4
  Bottom 0.2: ISP1.4 5.27,34.3 2.9,34.3 1.37,32.77 1.37,19.43 3.3,17.5 3.3,15.04 4.1,14.24 4.1,12.3 | v9.5,13.4 8.4,12.3 4.1,12.3 | 4.1,12.3 1.9,12.3 0.87,11.27 0.87,7.63 v1.4,7.1
SDA_HV  (via drill 0.25)
  Top 0.2: v1.39,4.41 0.78,3.8 0.78,1.37 0.97,1.18 R8.1 | 0.79,3.81 v1.39,4.41 | v3,8.29 3.1,8.4 U8.7 | U7.6 1.69,4.71 v1.39,4.41
  Bottom 0.2: v1.39,4.41 2.65,5.66 2.65,7.73 3,8.08 v3,8.29
SDA_OB
  Top 0.2: U3.5 11.34,24.9 | 11.34,24.9 11.34,27 11.34,27.46 11.34,28.71 R3.1 11.28,28.73 U4.1 | U1.7 9.07,24.9 11.34,24.9
SIG1
  Top 0.2: U8.9 4.4,7.4 4.9,6.9 6.34,6.9 7.09,7.65 7.9,7.65 8.05,7.5 8.05,5.7 7.45,5.1 5.7,5.1 5.4,4.8 D2.1
  Top 0.406: D2.1 4.6,3.1 U$1.2
SIG2
  Top 0.2: U8.3 5.17,9.37 5.36,9.57 10.83,9.57 11.86,8.54 11.86,6.09 10.96,5.2 8.1,5.2 7.3,4.4 D2.2
  Top 0.406: D2.2 8.1,3.1 U$1.1
SN_DE
  Top 0.2: U2.3 8.77,12.7 8.69,12.7 7.86,13.53 7.54,13.53 7.24,13.82 7.24,14.24 7.34,14.34 U3.15
SN_RE  (via drill 0.25)
  Top 0.2: v7.75,14.03 7.93,14.22 U3.16 | v10.21,11.31 10.04,11.49 U2.2
  Bottom 0.2: v7.75,14.03 7.77,14.01 9.6,14.01 10.21,13.41 v10.21,11.32 v10.21,11.31
STAT_LED  (via drill 0.25)
  Top 0.2: U3.2 11.88,15.72 12,15.6 12,14.73 v11.96,14.7 | v4.5,16 4.55,15.95 R1.2
  Bottom 0.2: v11.96,14.7 11.47,15.19 5.29,15.19 4.5,15.98 v4.5,16
TEMP_ALERT  (via drill 0.25)
  Top 0.2: v10.6,19.1 10.34,18.84 U3.6 | U4.3 8.72,30 v7.6,30
  Bottom 0.2: v7.6,30 10.9,26.7 10.9,19.4 v10.6,19.1
TEST_PIN
  Top 0.2: U3.10 7.89,18.22 U$12.P$1
TX
  Top 0.2: U2.4 7.5,11.61 8.36,10.75 10.44,10.75 10.75,11.06 10.75,13.35 10.48,13.62 10.11,13.62 9.84,13.89 U3.19
VIN+  (via drill 0.25, 0.3)
  Top 0.2: U7.8 2.49,4.83 2.59,4.73 C2.1 | R8.2 3.28,1.18 3.5,1.4 v3.5,1.6 | v10.7,5.9 10.65,5.95 9.63,5.95 9.42,6.16 9.42,7.41 8.46,8.36 5.33,8.36 5.28,8.4 U8.1
  Top 0.254: U5.1 1.35,14.25 v1.5,14.4 | v3.1,14.4 3.25,14.25 U5.3
  Top 0.305: R8.2 R4.2 2.59,2.42 C2.1
  Top 0.406: v1.4,9.88 1.2,9.88 0.9,10.18 Q2.1 0.9,12.01 C4.1 1.35,12.46 U5.1
  Bottom 0.2: v3.5,1.6 4.53,1.6 U$1.3 | 11.55,6 11.45,5.9 v10.7,5.9
  Bottom 0.254: v1.5,14.4 v3.1,14.4
  Bottom 0.406: U$1.3 5.47,1.67 8,4.2 10.97,4.2 11.55,4.78 11.55,6 11.55,8.32 8.7,11.18 4.1,11.18 2.8,9.88 v1.4,9.88
VIN-  (via drill 0.3)
  Top 0.406: v3,11.1 Q2.3
  Bottom 0.406: U$1.4 9.23,1.67 12.11,4.55 12.11,8.55 8.85,11.81 3.85,11.81 3.14,11.1 v3,11.1

### Text on the board
Reference: Andrew D. Wickert
bDocu: Project-TPDH-Walrus / v0.2.0 / 07-15-2019 / / Based on TP-Downhole by / Schulz, Sandell, Wickert / / A. Wickert / / Northern Widget LLC / and University of Minnesota